# EAGLE design MLX90393_breakout1_short (EAGLE 6.5.0)
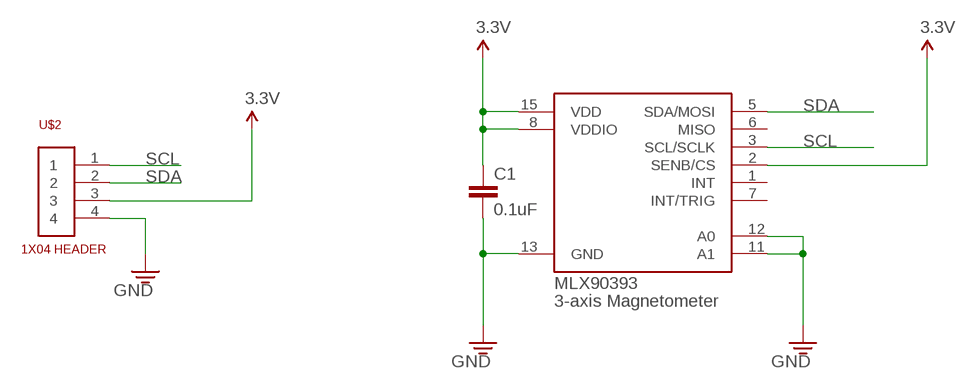
[diagram p0: schematic, sheet 1]

## Parts
C1  0.1uF  CAP0603  [0603]
U$1  MLX90393  [16-QFN]
U$2  1X04  [1X04]

## Nets
3.3V: C1.1 U$1.2(SENB/CS) U$1.8(VDDIO) U$1.15(VDD) U$2.3
GND: C1.2 U$1.11(A1) U$1.12(A0) U$1.13(GND) U$2.4
SCL: U$1.3(SCL/SCLK) U$2.1
SDA: U$1.5(SDA/MOSI) U$2.2
Unconnected: U$1.1(INT) U$1.6(MISO) U$1.7(INT/TRIG)

## Library data of the parts
C1 = lowfieldmri:CAP: Capacitor Standard 0603 ceramic capacitor, and 0.1" leaded capacitor.
U$1 = lowfieldmri:MLX90393: Melexis MLX90393 3-axis magnetometer
U$2 = lowfieldmri:1X04

## Board
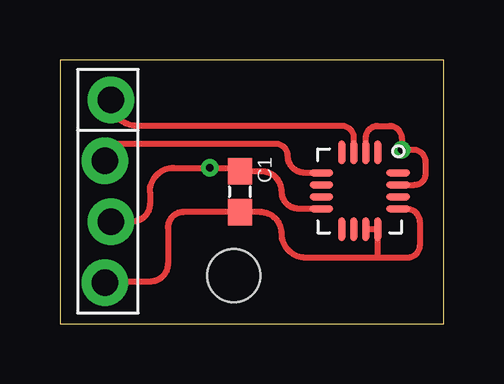
[diagram p1: board, top side]
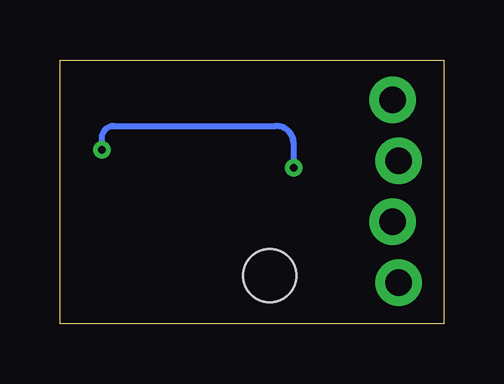
[diagram p2: board, bottom side, seen from below]

Size 16 x 11 mm. Coordinates in mm from the lower left corner, seen from the top.
Outline: 0,11 0,0 16,0 16,11 0,11
Copper layers (1*16): Top 0.035mm / dielectric 1.5mm / Bottom 0.035mm
Design rules "default": minimum track width 10mil, minimum drill 24mil, track to track 8mil, track to pad 8mil, pad to pad 8mil, via to via 8mil, smd to smd 8mil, copper to edge 40mil, drill to drill 8mil, minimum pad ring 10mil, minimum via ring 8mil, stop-mask expansion 4mil, vias tented up to drill 0mil, thermal gap 10mil
Holes 2.2 mm at 7.25,2

### Footprints (pad centres in the part's own frame; a part is rotated, then mirrored left to right if it is on the bottom)
0603 = smd 1.1 x 1: 1 -0.85,0; 2 0.85,0
16-QFN = smd 0.3 x 1: 1 0.75,1.6; 2 0.25,1.6; 3 -0.25,1.6; 4 -0.75,1.6; 9 -0.75,-1.6; 10 -0.25,-1.6; 11 0.25,-1.6; 12 0.75,-1.6 | smd 1 x 0.3: 5 -1.6,0.75; 6 -1.6,0.25; 7 -1.6,-0.25; 8 -1.6,-0.75; 13 1.6,-0.75; 14 1.6,-0.25; 15 1.6,0.25; 16 1.6,0.75
1X04 = drill 1.1 pad 1.93: 1 -5.08,0.127; 2 -2.54,-0.127; 3 0,0.127; 4 2.54,-0.127

### Placement (x,y rotation side)
C1  7.5,5.5 270 top
U$1  12.51,5.54 0 top
U$2  2,4.25 270 top

### Tracks (layer width: path | path; a pad name or v marks a point on that pad's centre or on a via)
3.3V  (via drill 0.33)
  Top 0.254: U$1.8 9.96,4.79 arc-90 9.25,5.5 arc90 8.4,6.35 C1.1 7.5,6.5 v6.25,6.5 | U$1.2 12.76,7.76 arc-90 13.25,8.25 13.75,8.25 arc-90 14.25,7.75 v14.25,7.25 14.75,7.25 arc-90 15.25,6.75 15.25,6.25 arc-90 14.79,5.79 U$1.15 | v6.25,6.5 6,6.5 | U$2.3 3,4.25 arc90 3.75,5 3.75,5.5 arc-90 4.75,6.5 v6.25,6.5
  Bottom 0.254: v6.25,6.5 6.25,7.5 arc-90 7,8.25 13.75,8.25 arc-90 14.25,7.75 v14.25,7.25
GND
  Top 0.254: U$1.13 14.46,4.79 arc-90 15,4.25 15,3.25 arc-90 14.5,2.75 13.26,2.75 | 13.26,2.75 10.25,2.75 arc-90 9.25,3.75 arc90 8.35,4.65 C1.2 5.15,4.65 arc90 4.5,4 4.5,2.5 arc-90 3.75,1.75 1.91,1.75 arc90 U$2.4 | U$1.11 U$1.12 13.26,2.75
SCL
  Top 0.254: U$1.3 12.26,7.74 arc90 11.75,8.25 3.21,8.25 arc-90 U$2.1
SDA
  Top 0.254: U$1.5 10.21,6.29 arc-90 9.5,7 arc90 9,7.5 2.58,7.5 arc90 U$2.2